# Altium schematic sheet Bandpass Amplifier.schdoc: Bandpass Amplifier
size A4; Organization: Altium Limited; Address1: L3, 12a Rodborough Rd; Address2: Frenchs Forest; Address3: NSW; Address4: Australia 2086; DocumentNumber: 1; SheetNumber: 1; SheetTotal: 1
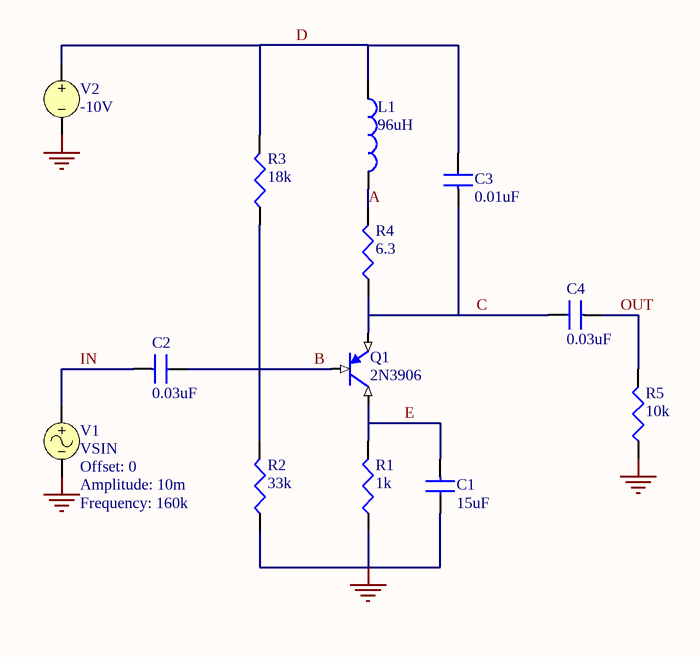
[diagram p0: Bandpass Amplifier.schdoc]

## Parts
C1  15uF
C2  0.03uF
C3  0.01uF
C4  0.03uF
L1  96uH
Q1  2N3906
R1  1k
R2  33k
R3  18k
R4  6.3
R5  10k
V1  VSIN  Offset: 0  Amplitude: 10m  Frequency: 160k
V2  value -10V  (hidden comment: VSRC)

## Nets
GND: C1.2 R1.2(BOT) R2.2(BOT) R5.2(BOT) V1.2 V2.2
A: L1.2 R4.1(TOP)
B: C2.2 Q1.2(B) R2.1(TOP) R3.2(BOT)
C: C3.1 C4.2 Q1.3(E) R4.2(BOT)
D: C3.2 L1.1 R3.1(TOP) V2.1
E: C1.1 Q1.1(C) R1.1(TOP)
IN: C2.1 V1.1
OUT: C4.1 R5.1(TOP)

## Notes on the sheet
- Title
- Size:
- Date:
- A4
- Number:
- Time:
- Revision:
- Sheet
- of
- File:

## Library data of the parts
C1-C4 = CAP: Capacitor
  C1: Value: 15uF
  C2 C4: Value: 0.03uF
  C3: Value: 0.01uF
L1 = INDUCTOR: Value: 96uH
Q1 = 2N3906: PNP BJT
R1-R5 = RES: Resistor
  R1: Value: 1k
  R2: Value: 33k
  R3: Value: 18k
  R4: Value: 6.3
  R5: Value: 10k
V1 = VSIN: Sinusoidal Voltage Source
V2 = VSRC: Voltage Source